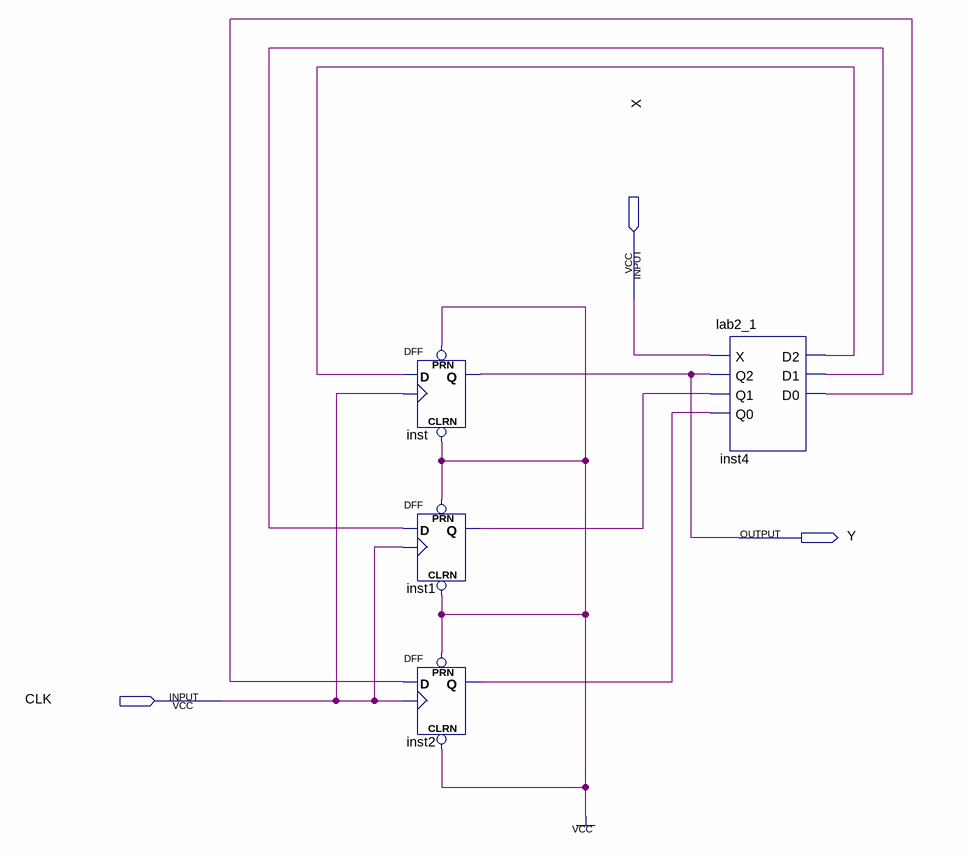
[diagram p0: schematic sheet]
// Quartus schematic Block2.bdf as structural Verilog: 4 symbols, 3 pins
module Block2 (
  input  X,
  input  CLK,
  output Y
);

  wire inst1_q, inst2_q, inst4_d0, inst4_d1, inst4_d2;

  DFF inst (.CLRN(1'b1), .CLK(CLK), .D(inst4_d2), .PRN(1'b1), .Q(Y));
  DFF inst1 (.CLRN(1'b1), .CLK(CLK), .D(inst4_d1), .PRN(1'b1), .Q(inst1_q));
  DFF inst2 (.CLRN(1'b1), .CLK(CLK), .D(inst4_d0), .PRN(1'b1), .Q(inst2_q));
  lab2_1 inst4 (.X(X), .Q2(Y), .Q1(inst1_q), .Q0(inst2_q), .D2(inst4_d2), .D1(inst4_d1), .D0(inst4_d0));
endmodule
